# EAGLE design Fuente Alimentación (EAGLE 9.6.2)
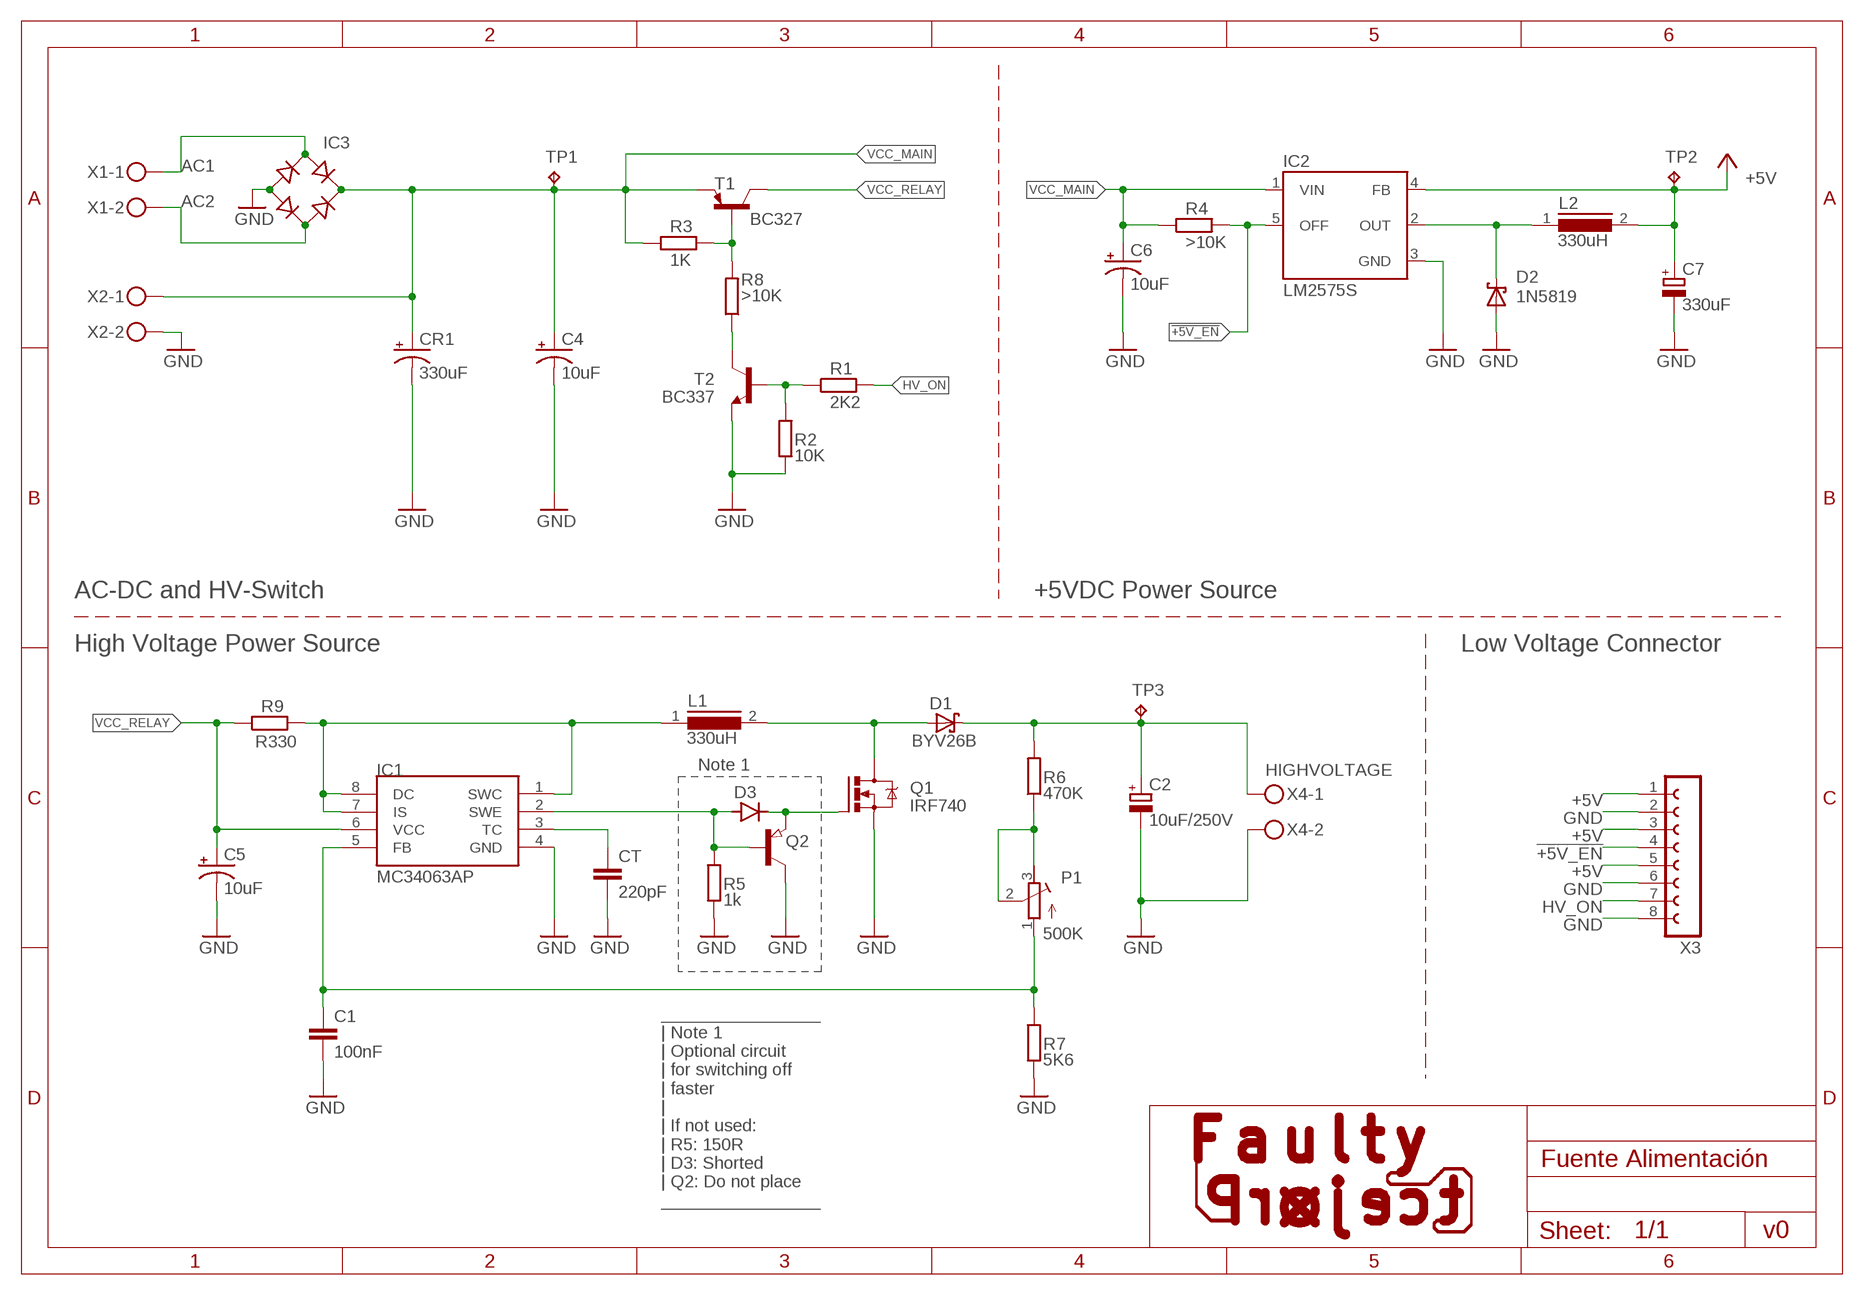
[diagram p0: schematic, sheet 1]

## Parts
C1  100nF  C-EUC1808  [C1808]
C2  10uF/250V  CPOL-EUE5-13  [E5-13]
C4  10uF  CPOL-US085CS-1AR  [085CS_1AR]
C5  10uF  CPOL-US085CS-1AR  [085CS_1AR]
C6  10uF  CPOL-US085CS-1AR  [085CS_1AR]
C7  330uF  CPOL-EUE5-10.5  [E5-10,5]
CR1  330uF  CPOL-USE5-13  [E5-13]
CT  220pF  C-EU025-024X044  [C025-024X044]
D1  BYV26B  1N5817-B  [DO41-7.6]
D2  1N5819  1N5819-T  [DO41-7.6]
D3  MBR0520LT  [SOD123]
IC1  MC34063AP  [DIL08]
IC2  LM2575S  [TO263-5]
IC3  B-DIL  [B-DIL]
L1  330uH  DR125  [DR125]
L2  330uH  DR125  [DR125]
P1  500K  R-TRIMM64W  [RTRIM64W]
Q1  IRF740  [TO220BV]
Q2  PNP-TRANSISTOR_SOT23  [SOT23]
R1  2K2  R-EU_0207/2V  [0207/2V]
R2  10K  R-EU_0207/2V  [0207/2V]
R3  1K  R-EU_0204/5  [0204/5]
R4  >10K  R-EU_0207/2V  [0207/2V]
R5  1k  R-EU_0204/2V  [0204V]
R6  470K  R-EU_0204/7  [0204/7]
R7  5K6  R-EU_0204/2V  [0204V]
R8  >10K  R-EU_0204/2V  [0204V]
R9  R330  R-EU_0204/2V  [0204V]
T1  BC327  [TO92]
T2  BC337  [TO92]
TP1  TPB1,27  [B1,27]
TP2  TPB1,27  [B1,27]
TP3  TPB1,27  [B1,27]
X1  MKDSN1,5/2-5,08  [MKDSN1,5/2-5,08]
X2  MKDSN1,5/2-5,08  [MKDSN1,5/2-5,08]
X3  FE08W  [FE08W]
X4  MKDSN1,5/2-5,08  [MKDSN1,5/2-5,08]

## Nets
!+5V_EN: IC2.5(OFF) R4.2 X3.4
+5V: C7.+ IC2.4(FB) L2.2 TP2.TP X3.1 X3.3 X3.5
AC1: IC3.AC2 X1.1
AC2: IC3.AC1 X1.2
CT: CT.1 IC1.3(TC)
GND: C1.2 C2.- C4.- C5.- C6.- C7.- CR1.- CT.2 D2.A IC1.4(GND) IC2.3(GND) IC3.- Q1.S Q2.3(C) R2.1 R5.1 R7.1 T2.1(E) X2.2 X3.2 X3.6 X3.8 X4.2
HIGHVOLTAGE: C2.+ D1.C R6.2 TP3.TP X4.1
HV_ON: R1.2 X3.7
N$1: D3.C Q1.G Q2.2(E)
N$2: C1.1 IC1.5(FB) P1.1(A) R7.2
N$3: D2.C IC2.2(OUT) L2.1
N$4: D1.A L1.2 Q1.D
N$5: P1.2(S) P1.3(E) R6.1
N$6: IC1.1(SWC) IC1.7(IS) IC1.8(DC) L1.1 R9.2
N$7: R3.2 R8.2 T1.2(B)
N$8: R1.1 R2.2 T2.2(B)
N$16: R8.1 T2.3(C)
SWE: D3.A IC1.2(SWE) Q2.1(B) R5.2
VCC_MAIN: C4.+ C6.+ CR1.+ IC2.1(VIN) IC3.+ R3.1 R4.1 T1.1(E) TP1.TP X2.1
VCC_RELAY: C5.+ IC1.6(VCC) R9.1 T1.3(C)

## Notes on the sheet
- AC-DC and HV-Switch | +5VDC Power Source
- High Voltage Power Source | Low Voltage Connector
- Note 1
- ________________
  | Note 1
  | Optional circuit 
  | for switching off 
  | faster
  |
  | If not used:
  | R5: 150R
  | D3: Shorted
  | Q2: Do not place
  ________________
- v0
- C:/Users/Abraham/Downloads/logo_mobile.bmp

## Library data of the parts
C1 CT = rcl:C-EU: CAPACITOR, European symbol
C2 C7 = rcl:CPOL-EU: POLARIZED CAPACITOR, European symbol
C4-C6 CR1 = rcl:CPOL-US: POLARIZED CAPACITOR, American symbol
D1 D2 = diode:1N581*: 1.0A SCHOTTKY BARRIER RECTIFIER Source: http://www.diodes.com/datasheets/ds23001.pdf
D3 = diode:MBR0520LT: SCHOTTKY BARRIER RECTIFIER Source: http://onsemi.com .. MBR0520LT1-D.pdf
IC1 = mc34063:MC34063
IC2 = v-reg-3:LM2575: National Semiconductor <http://www.national.com> 1.0A "Simple Switcher"(c) 52kHz, Vout 1.23-37V (HV: 57V), Vin 40V (HV: 60V), 50µA standby current
IC3 = rectifier:B-DIL: RECTIFIER
L1 L2 = inductors:DR125: High Power Density, High Efficiency, Shielded Inductors Source: coiltronics_dr_series.pdf
P1 = rcl:R-TRIMM: Trimm resistor
Q1 = transistor-power:IRF740: N-CHANNEL MOS FET
Q2 = semicon-smd-ipc:PNP-TRANSISTOR_: PNP TRANSISTOR
R1-R9 = rcl:R-EU_: RESISTOR, European symbol
T1 = transistor-pnp:BC327: PNP Transistor
T2 = transistor:BC337: NPN TRANSISTOR
TP1-TP3 = testpad:TP: Test pad
X1 X2 X4 = con-phoenix-508:MKDSN1,5/2-5,08: MKDSN 1,5/ 2-5,08 Printklemme Nennstrom: 13,5 A Nennspannung: 250 V Rastermaß: 5,08 mm Polzahl: 2 Anschlussart: Schraubanschluss Montage: Löten Anschlussrichtung Leiter/Platine: 0 ° Artikelnummer: 1729128 Source: http://eshop.phoenixcontact.com .. 1729128.pdf
X3 = con-lsta:FE08W: FEMALE HEADER; OC_FARNELL: unknown; OC_NEWARK: unknown

## Board
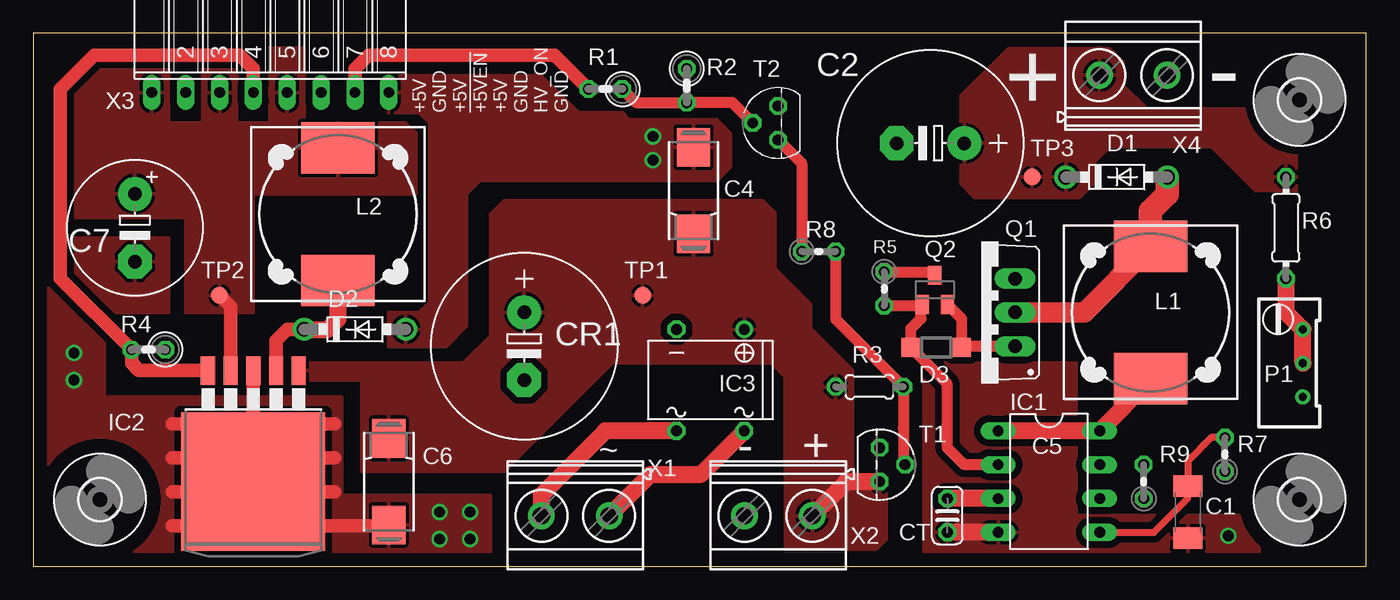
[diagram p1: board, top side]
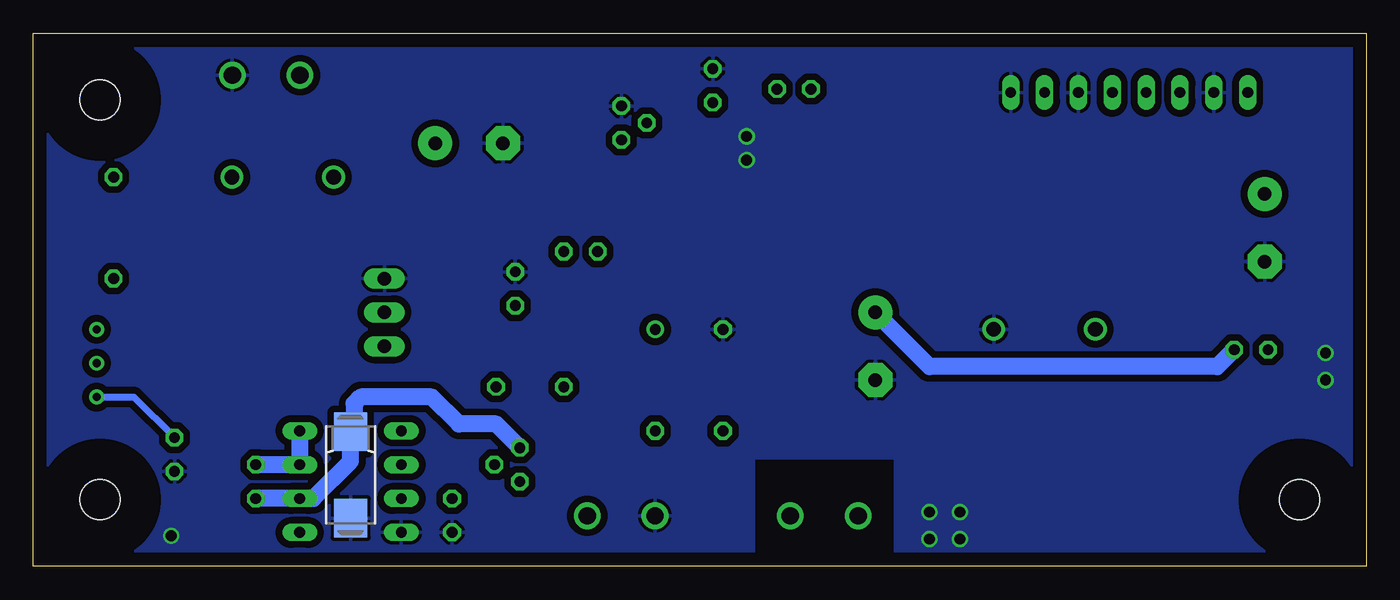
[diagram p2: board, bottom side, seen from below]

Size 100 x 40 mm. Coordinates in mm from the lower left corner, seen from the top.
Outline: 0,0 100,0 100,40 0,40 0,0
Copper layers (1*16): Top 0.035mm / dielectric 1.5mm / Bottom 0.035mm
Design rules "default": minimum track width 10mil, minimum drill 24mil, track to track 8mil, track to pad 8mil, pad to pad 8mil, via to via 8mil, smd to smd 8mil, copper to edge 40mil, drill to drill 8mil, minimum pad ring 10mil, minimum via ring 8mil, stop-mask expansion 4mil, vias tented up to drill 0mil, thermal gap 10mil

### Footprints (pad centres in the part's own frame; a part is rotated, then mirrored left to right if it is on the bottom)
C1808 = smd 1.6 x 2.2: 1 -1.95,0; 2 1.95,0
E5-13 = drill 1.016 pad 2.54: + -2.54,0 | drill 1.016 pad 2.54 octagon: - 2.54,0
085CS_1AR = smd 2.9 x 2.5: + 3.25,0; - -3.25,0
E5-10,5 = drill 1.016 pad 2.54: + -2.54,0 | drill 1.016 pad 2.54 octagon: - 2.54,0
C025-024X044 = drill 0.813 octagon: 1 -1.27,0; 2 1.27,0
DO41-7.6 = drill 1.1 pad 1.7: A 3.81,0; C -3.81,0
SOD123 = smd 1.4 x 1.4: A 1.9,0; C -1.9,0
DIL08 = drill 0.813 long: 1 -3.81,-3.81; 2 -1.27,-3.81; 3 1.27,-3.81; 4 3.81,-3.81; 5 3.81,3.81; 6 1.27,3.81; 7 -1.27,3.81; 8 -3.81,3.81
TO263-5 = smd 1.067 x 2.159: 1 -3.404,-5.791; 2 -1.702,-5.791; 3 0,-5.791; 4 1.702,-5.791; 5 3.404,-5.791 | smd 10.8 x 10.41: 6 0,2.54
B-DIL = drill 0.813: + -2.54,-3.81 | drill 0.813 octagon: - 2.54,-3.81; AC1 2.54,3.81; AC2 -2.54,3.81
DR125 = smd 3.85 x 5.5: 1 -4.975,0; 2 4.975,0
RTRIM64W = drill 0.61: 1 1.27,-2.54; 2 1.27,0; 3 1.27,2.54
TO220BV = drill 1.016 long: D 0,-2.54; G -2.54,-2.54; S 2.54,-2.54
SOT23 = smd 1 x 1.4: 1 -0.95,-1.1; 2 0.95,-1.1; 3 0,1.1
0207/2V = drill 0.813 octagon: 1 -1.27,0; 2 1.27,0
0204/5 = drill 0.813 octagon: 1 -2.54,0; 2 2.54,0
0204V = drill 0.813 octagon: 1 -1.27,0; 2 1.27,0
0204/7 = drill 0.813 octagon: 1 -3.81,0; 2 3.81,0
TO92 = drill 0.813 octagon: 1 1.27,0; 2 0,1.905; 3 -1.27,0
B1,27 = smd 1.27 x 1.27: TP 0,0
3,0 = hole 3: 0,0
MKDSN1,5/2-5,08 = drill 1.3 pad 2: 1 -2.561,0.025; 2 2.519,0.025
FE08W = drill 0.813 long: 1 -8.89,0; 2 -6.35,0; 3 -3.81,0; 4 -1.27,0; 5 1.27,0; 6 3.81,0; 7 6.35,0; 8 8.89,0

### Placement (x,y rotation side)
C1  86.61,4.06 270 top
C2  67.31,31.75 180 top
C4  49.53,28.19 270 top
C5  76.2,6.86 90 bottom
C6  26.67,6.35 90 top
C7  7.62,25.4 270 top
CR1  36.83,16.51 270 top
CT  68.58,3.81 270 top
D1  81.28,29.21 0 top
D2  24.13,17.78 0 top
D3  67.73,16.42 180 top
IC1  76.2,6.35 270 top
IC2  16.51,8.89 180 top
IC3  50.8,13.97 180 top
L1  83.82,19.05 90 top
L2  22.86,26.42 90 top
P1  93.98,15.24 0 top
Q1  71.12,19.05 90 top
Q2  67.63,20.74 0 top
R1  42.93,35.81 180 top
R2  49.02,36.07 270 top
R3  62.74,13.46 0 top
R4  8.64,16.26 180 top
R5  63.84,20.83 270 top
R6  93.98,25.4 90 top
R7  89.41,8.38 90 top
R8  58.93,23.62 0 top
R9  83.31,6.35 90 top
T1  63.5,7.62 270 top
T2  55.88,33.27 90 top
TP1  45.72,20.32 0 top
TP2  13.97,20.32 0 top
TP3  74.93,29.21 0 top
U$1  [3,0]  5,5 0 top
U$2  [3,0]  95,5 0 top
U$3  [3,0]  95,35 0 top
X1  40.64,3.81 180 top
X2  55.88,3.81 180 top
X3  17.78,35.56 0 top
X4  82.55,36.83 0 top

### Tracks (layer width: path | path; a pad name or v marks a point on that pad's centre or on a via)
!+5V_EN
  Top 1.016: IC2.5 7.92,14.68 7.37,15.24 R4.2 2.03,21.59 2.03,35.81 4.57,38.35 15.49,38.35 16.51,37.34 X3.4
+5V
  Top 1.016: IC2.4 14.81,19.48 TP2.TP
  Top 1.27: L2.2 22.86,31.75
  pour Top (isolate 0.508): 11.43,26.16 0.51,26.16 0.51,39.62 10.16,39.62 10.16,33.27 12.7,33.27 12.7,39.62 15.24,39.62 15.24,33.27 17.78,33.27 17.78,39.62 20.32,39.62 20.32,33.27 27.94,33.27 28.7,32.51 28.7,27.94 16.51,27.94 16.51,19.05 11.43,19.05
AC1
  Top 1.27: IC3.AC2 50.04,6.86 46.27,6.86 X1.1
AC2
  Top 1.27: IC3.AC1 42.93,10.16 38.1,5.33 38.1,3.81 X1.2
CT
  Top 1.27: IC1.3 CT.1
GND  (via drill 0.81)
  Top 0.813: R5.1 67.38,22.1 Q2.3
  Top 1.016: C6.- 26.62,3.05 21.59,3.05 16.51,8.13 IC2.3 | 11.43,3.05 10.41,3.05 | 22.61,5.59 21.59,5.59 | 22.61,8.13 21.59,8.13 | 22.61,10.67 21.59,10.67 | 11.43,10.67 10.41,10.67 | 11.43,8.13 10.41,8.13 | 11.43,5.59 10.41,5.59
  Top 1.27: IC1.4 CT.2
  other vias: 30.48,4.06 30.48,2.03 46.48,30.48 46.48,32.26 32.77,4.06 32.77,2.03 3.05,16 3.05,13.97 89.66,2.29
  pour Bottom (isolate 0.508): 0.51,0.51 35.31,0.51 35.31,8.13 45.97,8.13 45.97,0.51 99.57,0.51 99.57,39.62 0.51,39.62
  pour Top (isolate 0.508): 10.16,19.05 10.16,24.64 0.51,24.64 0.51,0.51 34.29,0.51 34.29,5.33 23.11,5.33 23.11,12.7 5.33,12.7 5.33,19.05
  pour Top (isolate 0.508): 26.67,16.51 26.67,19.05 28.96,19.05 29.72,19.81 29.72,33.27 28.96,34.04 26.16,34.04 26.16,36.83 38.1,36.83 40.89,34.04 44.2,34.04 44.7,33.53 51.31,33.53 52.32,32.51 52.32,29.97 51.31,28.96 33.53,28.96 32.51,27.94 32.51,18.03 30.99,16.51
  pour Top (isolate 0.508): 91.95,0.51 66.8,0.51 66.8,15.24 78.23,15.24 78.23,3.81 91.95,3.81
HIGHVOLTAGE
  pour Top: 70.61,27.69 69.6,28.7 69.6,35.31 73.15,38.86 80.77,38.86 81.79,37.85 81.79,36.07 83.57,34.29 94.74,34.29 94.74,28.19 91.69,28.19 88.39,31.5 80.77,31.5 79.5,30.23 79.5,28.7 78.49,27.69
HV_ON
  Top 1.016: X3.7 24.13,37.34 25.15,38.35 39.12,38.35 R1.2
N$1
  Top 0.813: Q1.G 69.72,16.51 D3.C 69.63,18.59 Q2.2
N$2
  Top 0.508: 86.61,5.59 86.61,5.08 84.07,2.54 IC1.5 | R7.2 88.39,9.65 86.61,7.87 C1.1
  Top 1.016: 86.61,5.59 C1.1
  Bottom 0.508: P1.1 92.46,12.7 R7.2
N$3
  Top 1.016: IC2.2 18.21,16.94 19.05,17.78 D2.C
  Top 1.27: D2.C 22.1,17.78 22.86,18.54 L2.1
N$4
  Top 1.524: Q1.D 78.84,19.05 L1.2
  Top 1.778: D1.A 85.09,27.94 83.82,26.67 L1.2
N$5
  Top 1.27: P1.2 P1.3 93.98,19.05 R6.1
N$6
  Top 1.27: L1.1 83.82,13.97 IC1.8 IC1.1
  Bottom 1.27: IC1.8 IC1.7 R9.2
N$7
  Top 0.813: R8.2 60.2,18.54 R3.2 65.28,10.41 65.28,7.75 T1.2
N$8
  Top 0.813: R1.1 45.21,34.8 R2.2 52.45,34.8 T2.2
N$16
  Top 0.813: T2.3 57.66,30.23 R8.1
SWE
  Top 0.813: R5.2 66.59,19.56 | 66.59,19.56 Q2.1 | 66.59,19.56 66.59,18.59 65.83,17.83 D3.A 68.58,13.68 68.58,8.89 69.85,7.62 IC1.2
VCC_MAIN
  Top 1.27: T1.1 61.01,6.35 X2.1
  Bottom 1.27: R4.1 11.18,14.99 32.77,14.99 CR1.+
  pour Top (isolate 0.508): 20.32,15.24 20.32,13.97 24.64,13.97 24.64,7.11 35.31,7.11 43.43,15.23 55.12,15.24 55.37,15.24 56.39,14.22 56.41,1.27 63.25,1.27 64.01,2.03 64.01,6.86 61.47,6.86 61.47,14.73 58.31,17.89 58.31,19.67 55.63,22.35 55.63,26.53 54.72,27.43 35.31,27.43 34.29,26.42 34.29,17.27 32.26,15.24
VCC_RELAY
  Bottom 0.813: 76.15,10.16 C5.+
  Bottom 1.27: IC1.6 R9.1 | IC1.6 79.25,5.08 | C5.+ 75.95,9.85 75.95,12.19 75.44,12.7 70.1,12.7 68.07,10.67 65.28,10.67 T1.3 | IC1.6 78.99,5.08 76.2,7.87 76.2,9.4 76.45,9.65 76.45,9.85 76.15,10.16

### Text on the board
tPlace: - | +5V / GND / +5V / !+5VEN! / +5V / GND / HV_ON / GND | + | ~ | - | +